# EasyEDA Pro project ProPrj_叶菜清洗机_2026-03-05.epro

# Schematic Schematic1

## Sheets
1 电源设计及主控外围设计: Board Name: Board1; Create Date: 2026-03-05; Page Name: 电源设计及主控外围设计; Project Name: 叶菜清洗机; Schematic Name: Schematic1; Update Date: 2026-03-05; Company: 嘉立创EDA; Page Size: A4; Version: V1.0
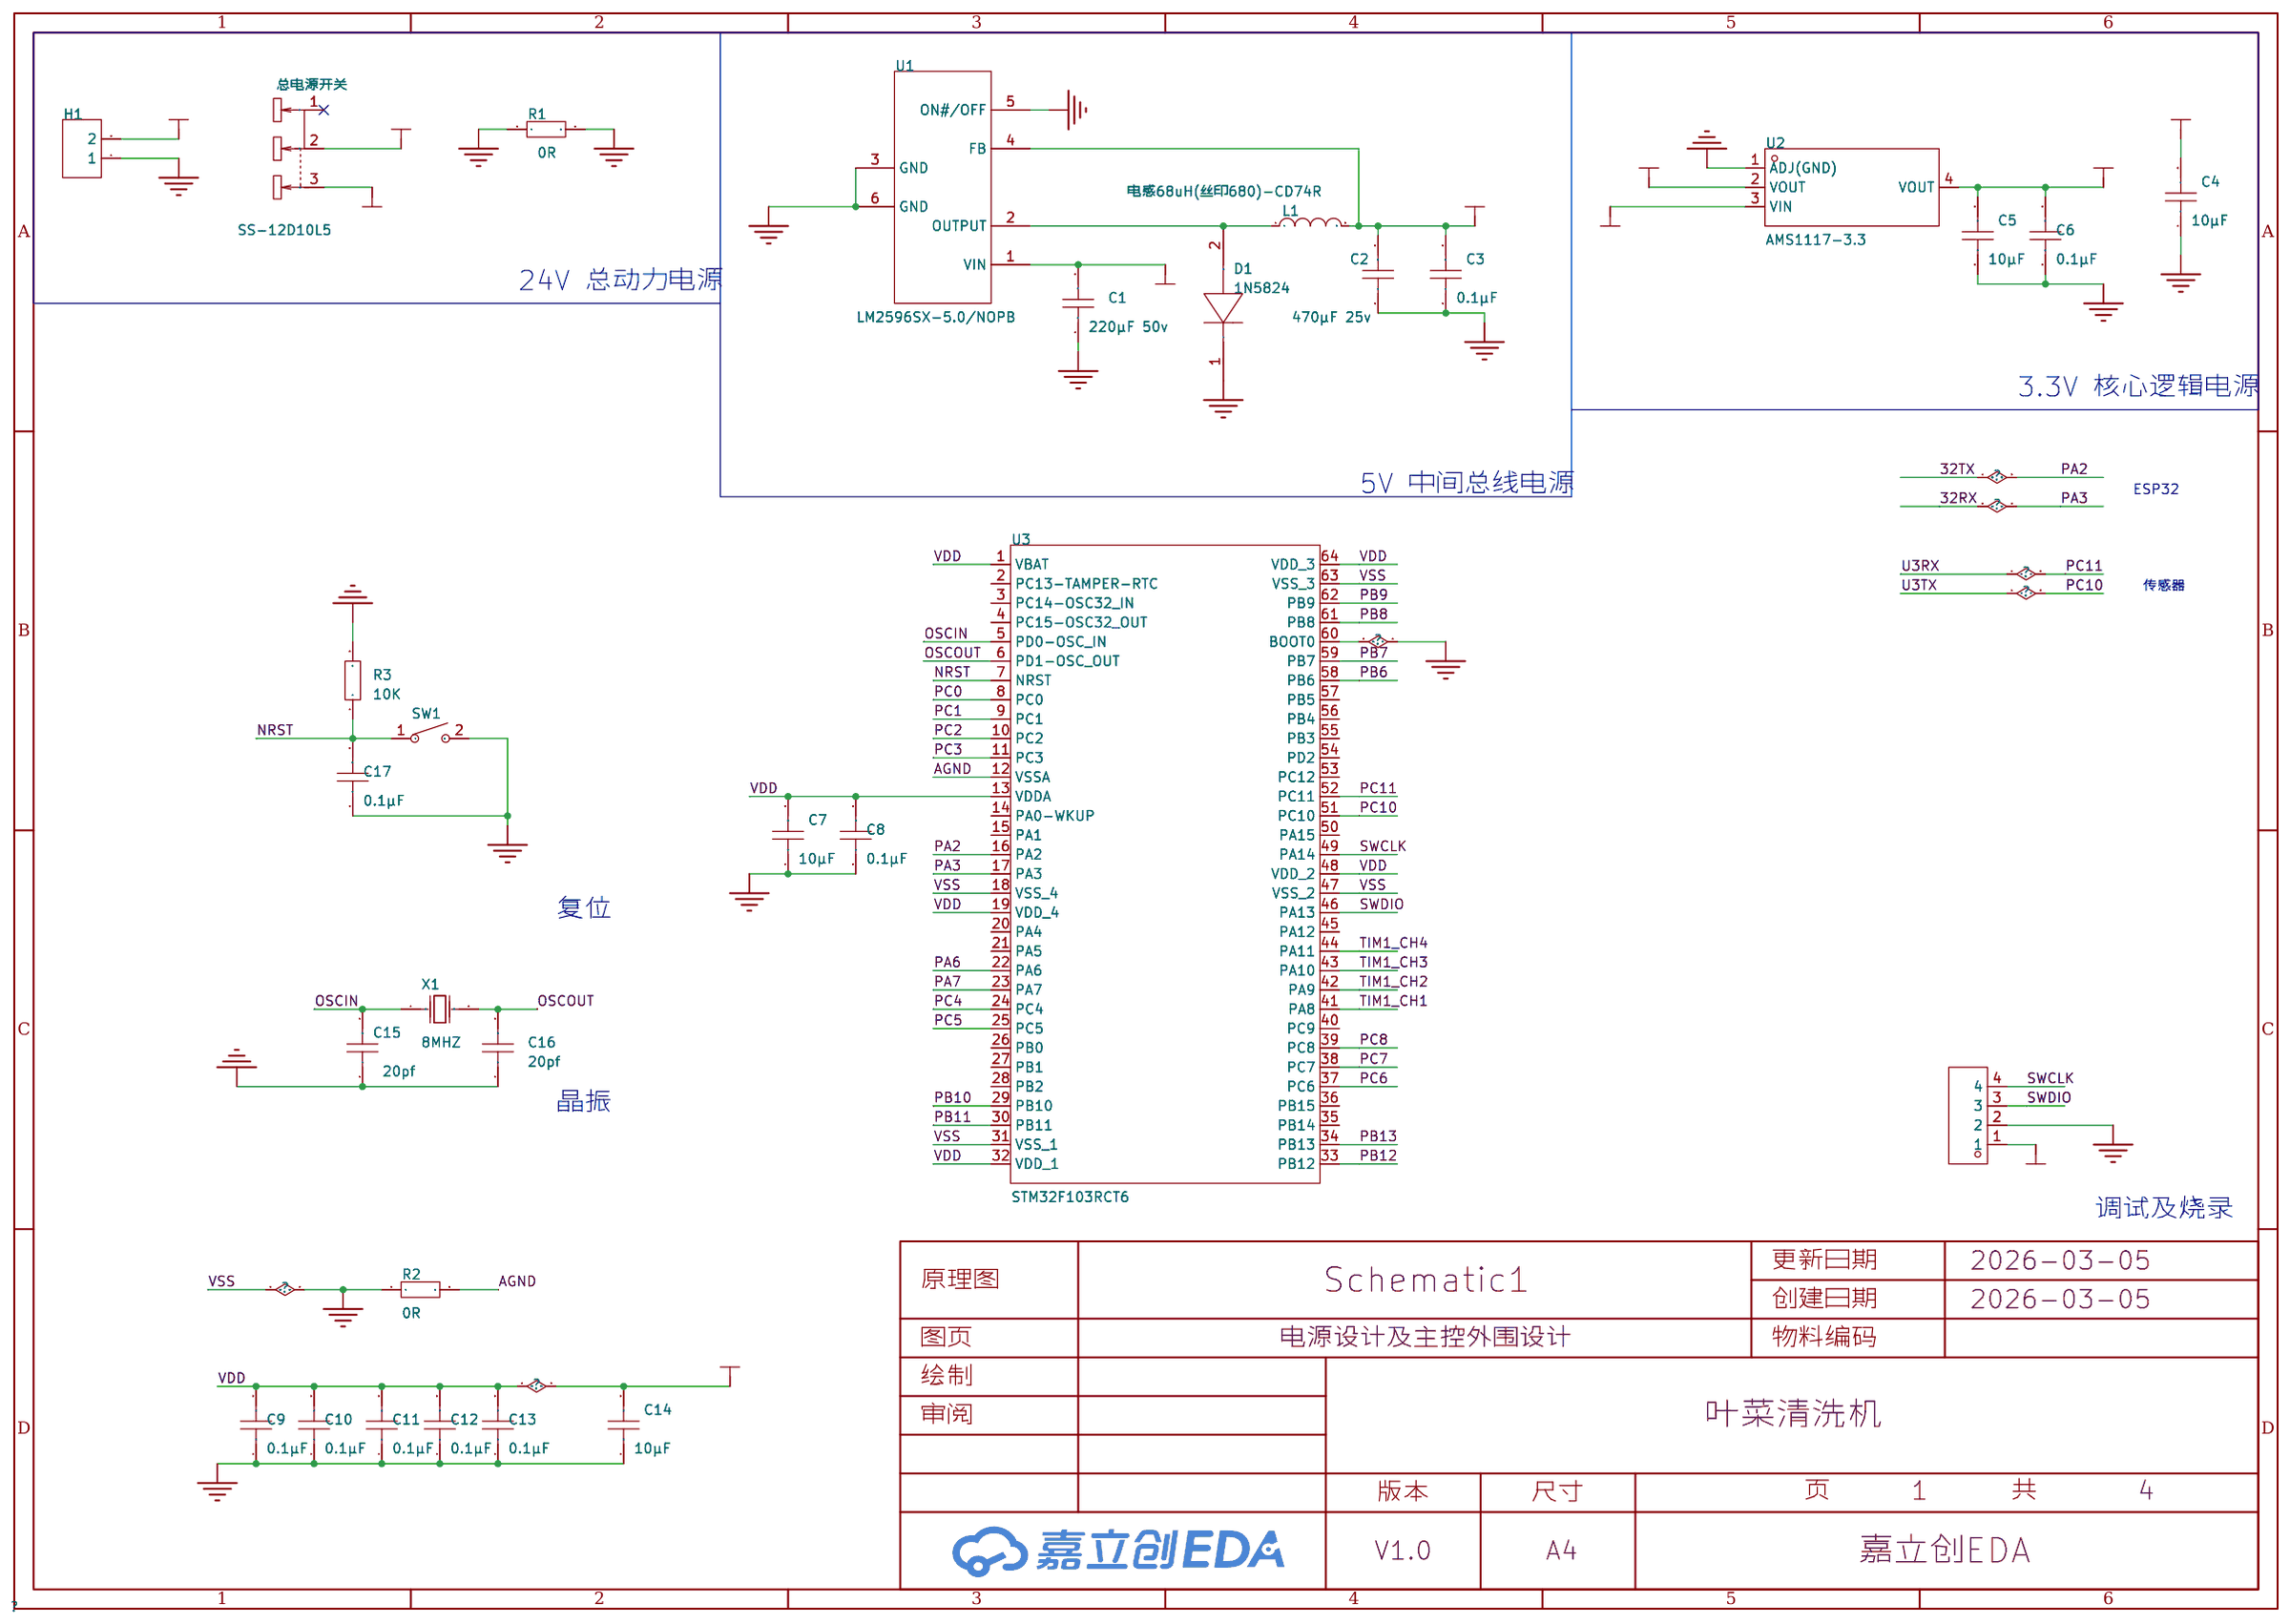
[diagram p0: 电源设计及主控外围设计]
2 电机驱动: Page Name: 电机驱动
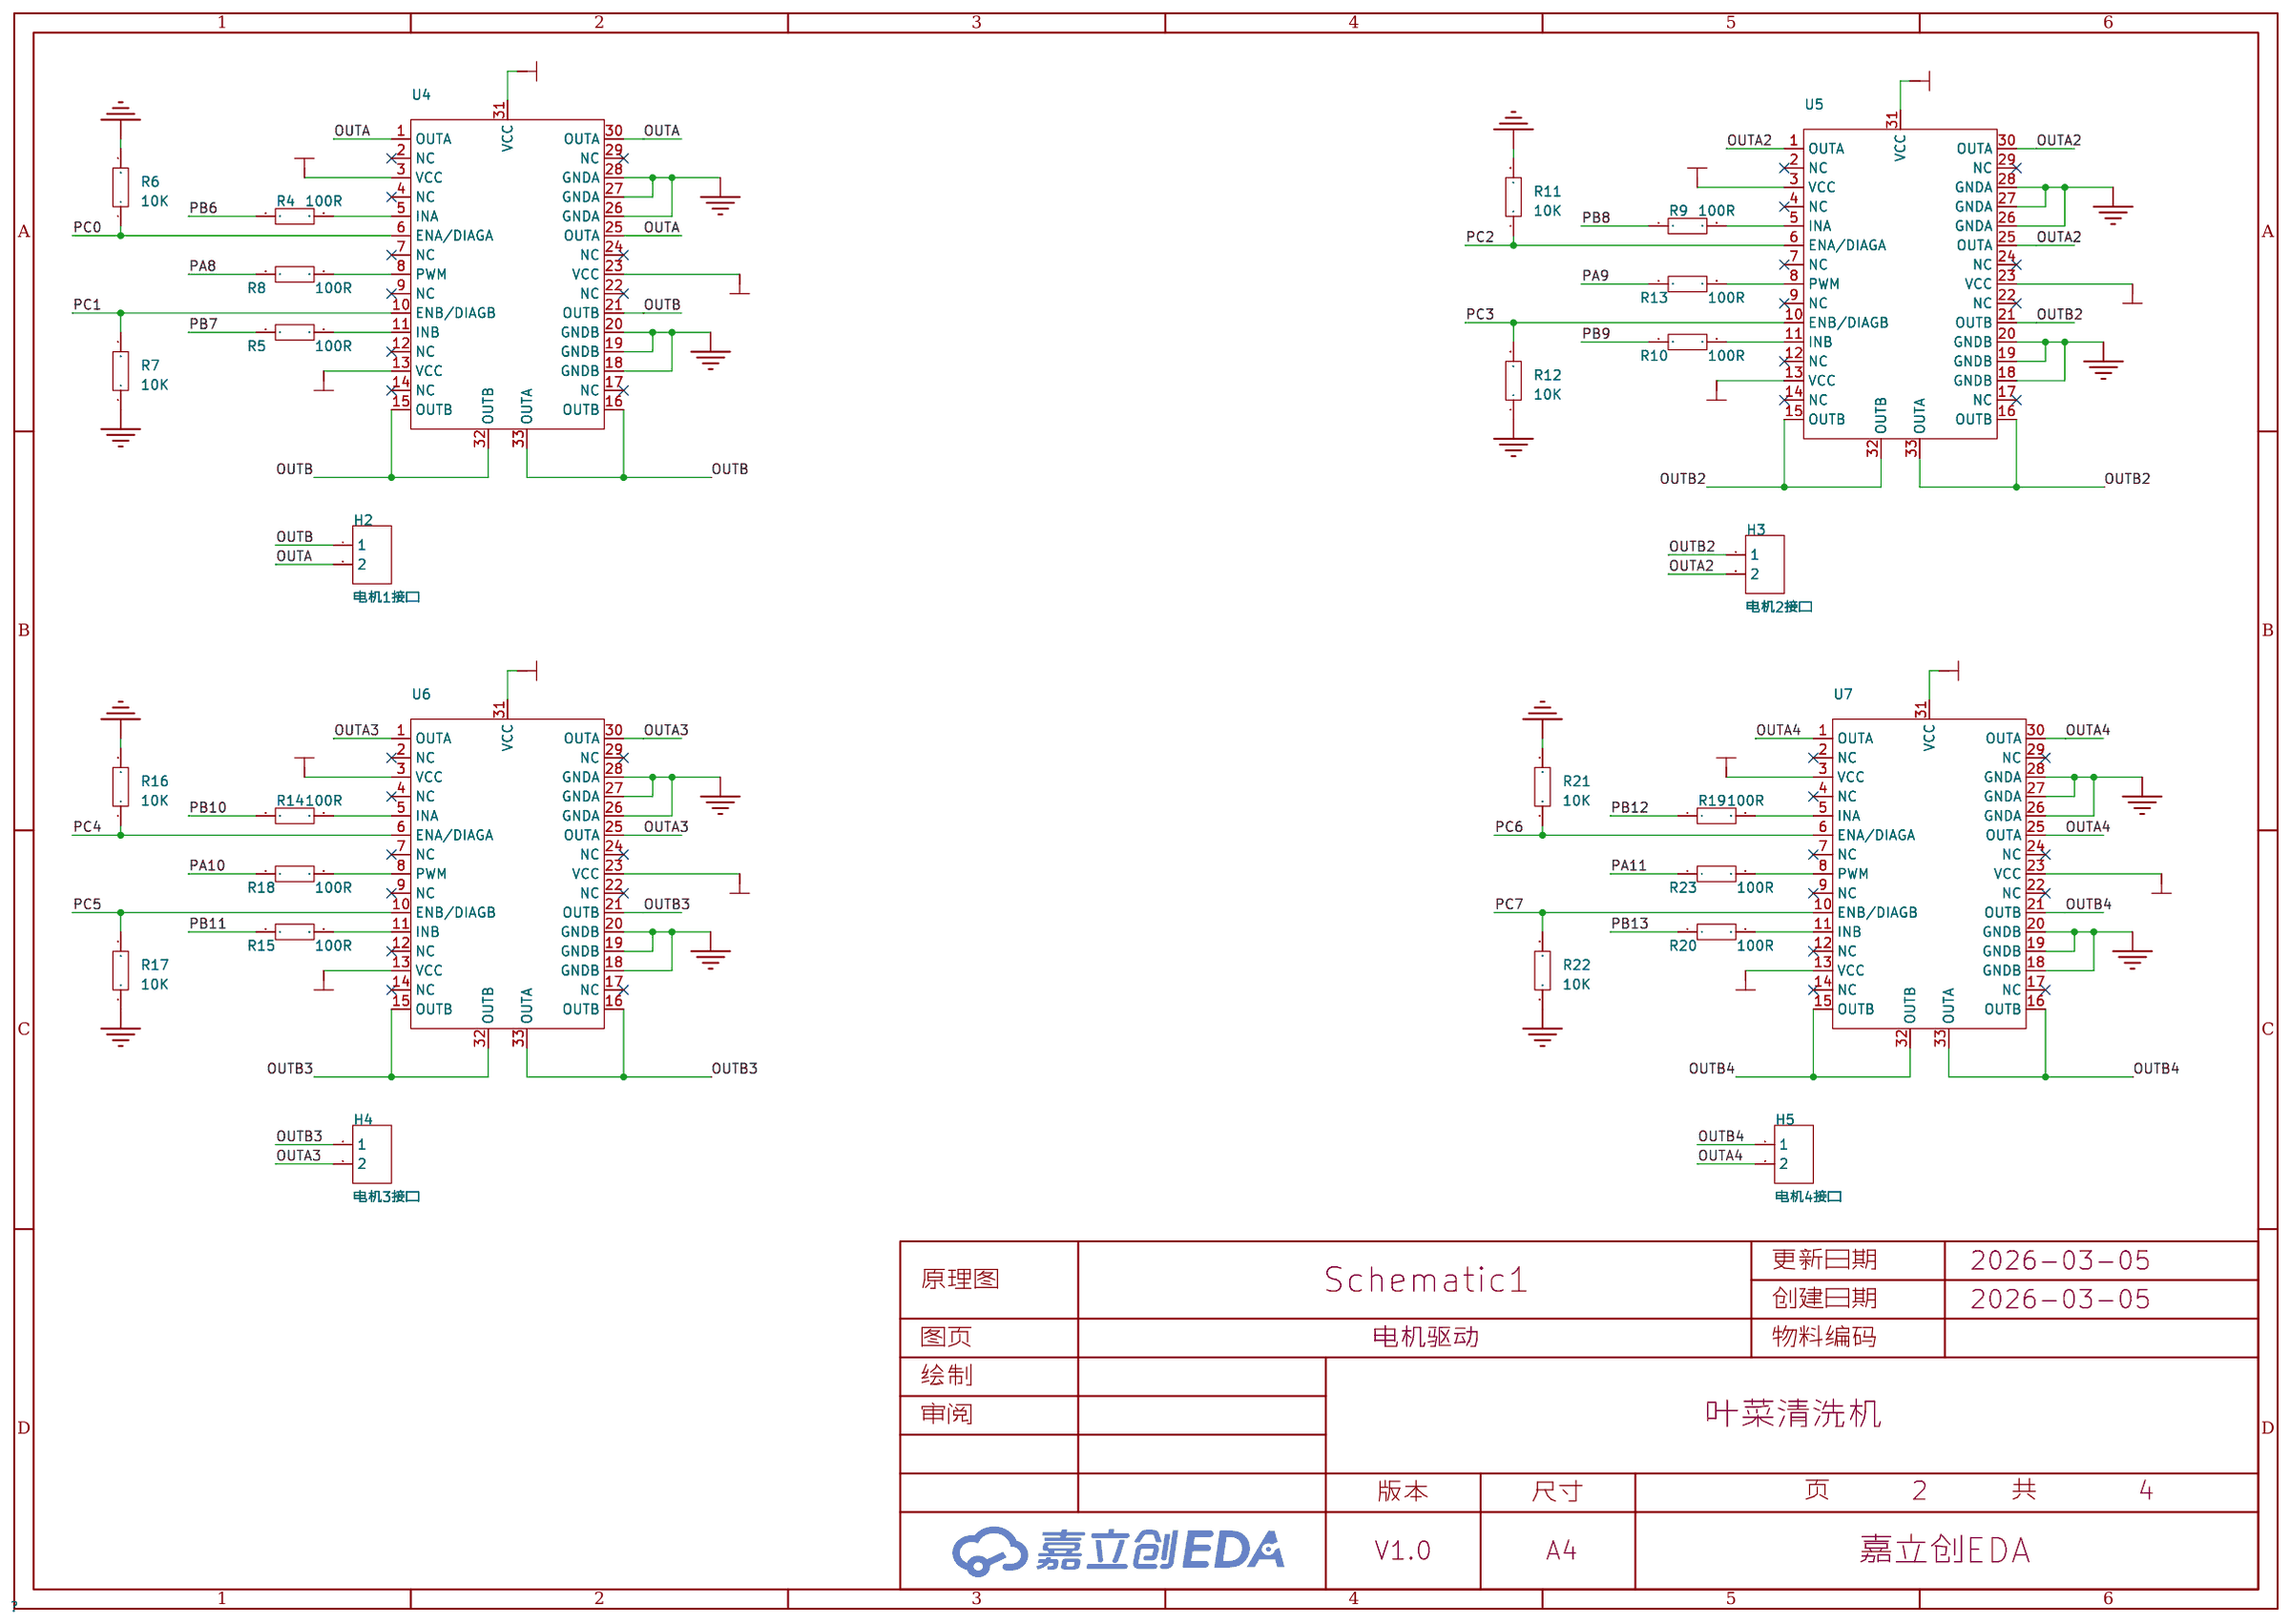
[diagram p1: 电机驱动]
3 水泵，传感器及ESP32: Page Name: 水泵，传感器及ESP32
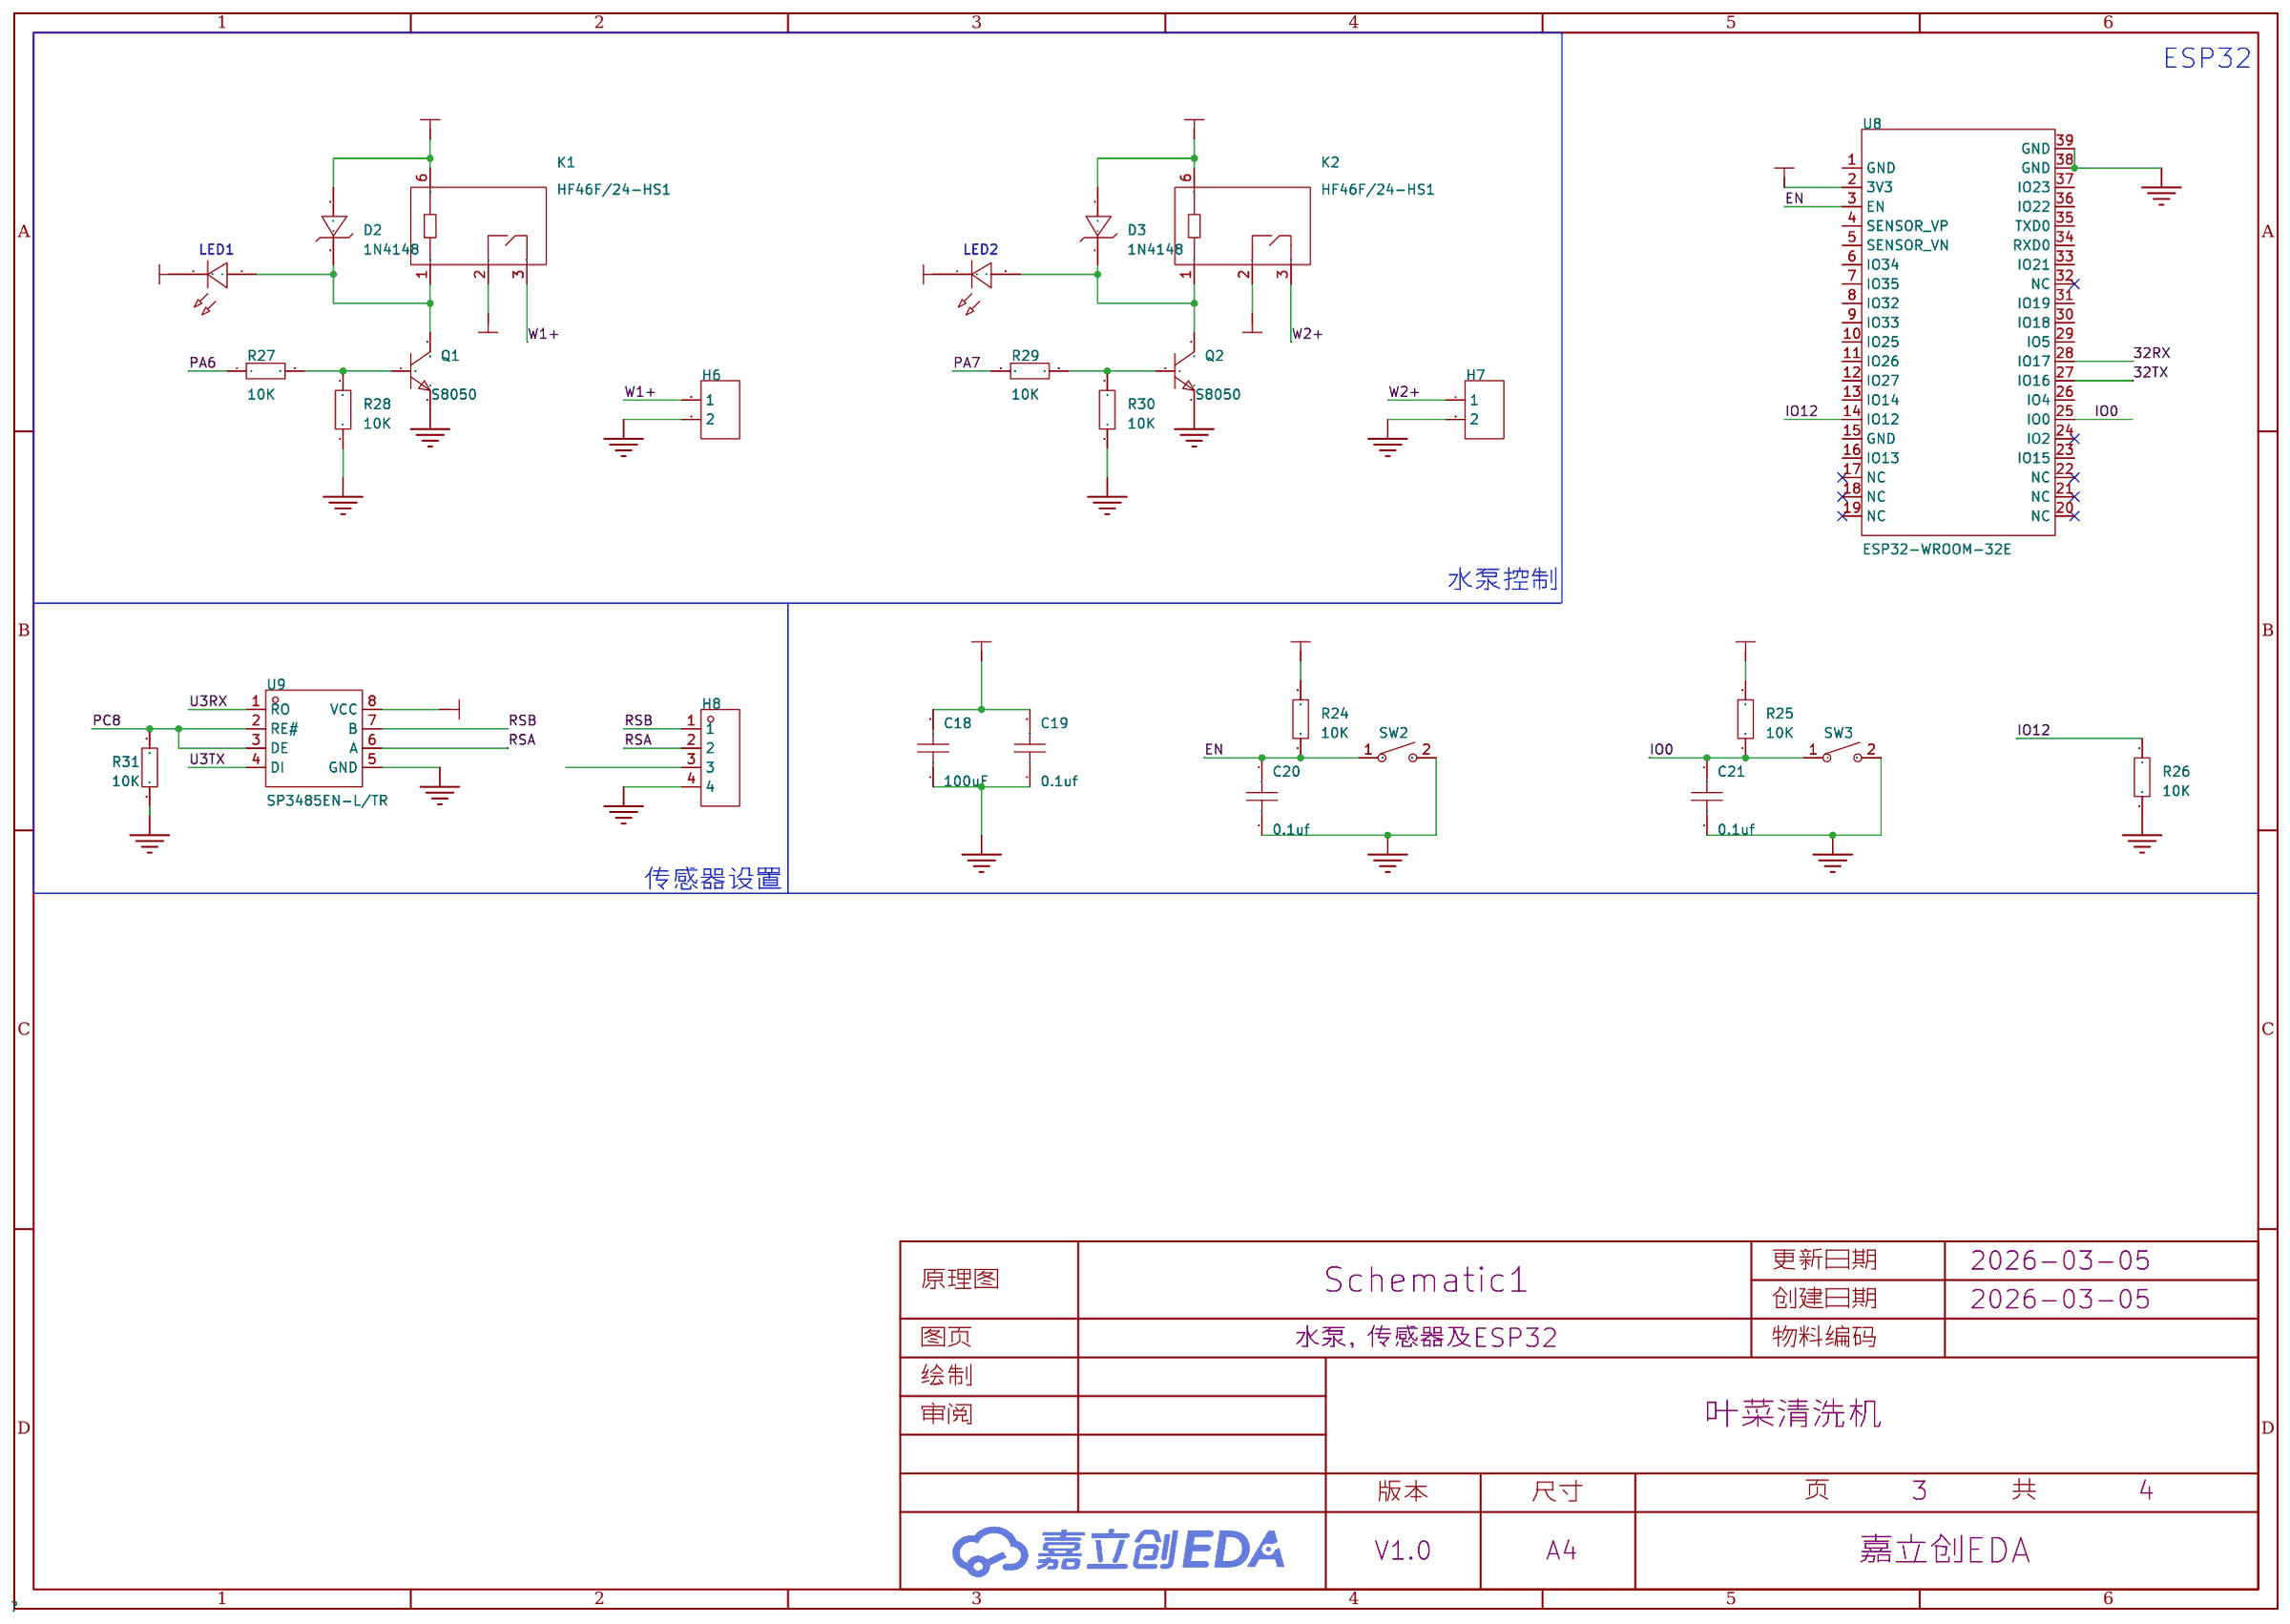
[diagram p2: 水泵，传感器及ESP32]

## Parts
sheet 水泵，传感器及ESP32
C18  100uF  [C0603]
C19  0.1uf  [C0603]
C20  0.1uf  [C0603]
C21  0.1uf  [C0603]
D2  1N4148  [SOD-123_L2.7-W1.7-LS3.8-RD]
D3  1N4148  [SOD-123_L2.7-W1.7-LS3.8-RD]
H6  -  [HDR-TH_2P-P2.54-V-F]
H7  -  [HDR-TH_2P-P2.54-V-F]
H8  -  [HDR-TH_4P-P2.54-V-F]
K1  HF46F/24-HS1  [RELAY-TH_HF46F-24-HS1T]
K2  HF46F/24-HS1  [RELAY-TH_HF46F-24-HS1T]
LED1  -  [LED_0603]
LED2  -  [LED_0603]
Q1  S8050  [SOT-23-3_L2.9-W1.3-P1.90-LS2.4-BR]
Q2  S8050  [SOT-23-3_L2.9-W1.3-P1.90-LS2.4-BR]
R24  10K  [R0603]
R25  10K  [R0603]
R26  10K  [R0603]
R27  10K  [R0603]
R28  10K  [R0603]
R29  10K  [R0603]
R30  10K  [R0603]
R31  10K  [R0603]
SW2  贴片按键ANJIAN_2PIN  [SW-SMD_L6.0-W3.6-LS8.0]
SW3  贴片按键ANJIAN_2PIN  [SW-SMD_L6.0-W3.6-LS8.0]
U8  ESP32-WROOM-32E  [WIFI-SMD_ESP32-WROOM-32E-A]
U9  SP3485EN-L/TR  [SOIC-8_L5.0-W4.0-P1.27-LS6.0-BL]
sheet 电机驱动
H2  电机1接口  [HDR-TH_2P-P2.54-V-F]
H3  电机2接口  [HDR-TH_2P-P2.54-V-F]
H4  电机3接口  [HDR-TH_2P-P2.54-V-F]
H5  电机4接口  [HDR-TH_2P-P2.54-V-F]
R4  100R  [R0603]
R5  100R  [R0603]
R6  10K  [R0603]
R7  10K  [R0603]
R8  100R  [R0603]
R9  100R  [R0603]
R10  100R  [R0603]
R11  10K  [R0603]
R12  10K  [R0603]
R13  100R  [R0603]
R14  100R  [R0603]
R15  100R  [R0603]
R16  10K  [R0603]
R17  10K  [R0603]
R18  100R  [R0603]
R19  100R  [R0603]
R20  100R  [R0603]
R21  10K  [R0603]
R22  10K  [R0603]
R23  100R  [R0603]
U4  VNH3SP30-E  [MULTIPOWERSO-30_L17.2-W16.0-P1.00-LS19.0-BL]
U5  VNH3SP30-E  [MULTIPOWERSO-30_L17.2-W16.0-P1.00-LS19.0-BL]
U6  VNH3SP30-E  [MULTIPOWERSO-30_L17.2-W16.0-P1.00-LS19.0-BL]
U7  VNH3SP30-E  [MULTIPOWERSO-30_L17.2-W16.0-P1.00-LS19.0-BL]
sheet 电源设计及主控外围设计
C1  220µF 50v  [C0603]
C2  470µF 25v  [C0603]
C3  0.1µF  [C0603]
C4  10µF  [C0603]
C5  10µF  [C0603]
C6  0.1µF  [C0603]
C7  10µF  [C0603]
C8  0.1µF  [C0603]
C9  0.1µF  [C0603]
C10  0.1µF  [C0603]
C11  0.1µF  [C0603]
C12  0.1µF  [C0603]
C13  0.1µF  [C0603]
C14  10µF  [C0603]
C15  20pf  [C0603]
C16  20pf  [C0603]
C17  0.1µF  [C0603]
D1  1N5824  [DIO-TH_BD11.4-L8.9-P13.7-RD]
H1  -  [HDR-TH_2P-P2.54-V-F]
L1  电感68uH(丝印680)-CD74R  [IND-SMD_L7.3-W7.3]
R1  0R  [R0603]
R2  0R  [R0603]
R3  10K  [R0603]
SW1  贴片按键ANJIAN_2PIN  [SW-SMD_L6.0-W3.6-LS8.0]
U1  LM2596SX-5.0/NOPB  [TO-263-5_L10.2-W8.9-P1.70-TL]
U2  AMS1117-3.3  [SOT-223-3_L6.5-W3.4-P2.30-LS7.0-BR]
U3  STM32F103RCT6  [LQFP-64_L10.0-W10.0-P0.50-LS12.0-BL]
X1  8MHZ  [HC-49S_L11.5-W5.0-P4.88]
总电源开关  SS-12D10L5  [SW-TH_SS-12D10L5]
调试  -  [HDR-TH_4P-P2.54-V-F]

## Library data of the parts
C1-C21 = CAP_0603: Supplier Footprint: 0603
D2 D3 = 1N4148: Supplier Part: C9900009645; Supplier Footprint: SOD-123_L2.7-W1.7--LS3.8-RD; JLCPCB Part Class: 扩展库; Supplier: LCSC
H1-H7 = HDR-F_2.54_1x2P: Supplier Part: C49661; Supplier Footprint: 插件
H8 调试 = HDR-F_2.54_1x4P: Supplier Part: C2718488; Supplier Footprint: 插件
K1 K2 = HF46F/24-HS1: 线圈电压:24V;触点形式:一组常开:1A(单刀单掷-常开);触点容量(电阻负载):5A@30VDC；5A@250VAC;最大切换电压:277V@AC；30V@DC;最大切换电流:5A;; LCSC Part Name: 超小型中功率24V继电器 单刀单掷-常开; Supplier Part: C5116035; Manufacturer: HF(宏发); Supplier Footprint: 插件,20.5x7mm; JLCPCB Part Class: 扩展库; Datasheet: https://item.szlcsc.com/datasheet/HF46F%252F24-HS1/5690957.html; Supplier: LCSC; Coil Voltage: 24V; Contact Form: 一组常开:1A(单刀单掷-常开); Number of Pins: 4; Contact Rating: 5A@30VDC；5A@250VAC; Switching Voltage(Max): 277V@AC；30V@DC; Coil Rated Power: 200mW; Contact Material: AgNi; Switching Current(Max): 5A; Coil Type: 无极性-单线圈; Coil Resistance: 2.88kΩ; Contact Resistance: 100mΩ; Operate Time: 10ms; Release Time: 10ms; Operating Temperature: -40℃~+85℃
LED1 LED2 = LED_0603-G: Supplier Footprint: 0603
Q1 Q2 = S8050: 晶体管类型:NPN;集电极电流(Ic):500mA;集射极击穿电压(Vceo):25V;耗散功率(Pd):300mW;直流电流增益(hFE):400@50mA,1V;; LCSC Part Name: NPN 电流:500mA 电压:25V; Supplier Part: C2931719; Manufacturer: Doeshare(德芯); Supplier Footprint: SOT-23; JLCPCB Part Class: 扩展库; Datasheet: https://item.szlcsc.com/datasheet/S8050/3273402.html; Supplier: LCSC; type: NPN; Current - Collector(Ic): 500mA; Collector - Emitter Voltage VCEO: 25V; Pd - Power Dissipation: 300mW; DC Current Gain: 400@50mA,1V; Transition frequency(fT): 150MHz; Current - Collector Cutoff: 100nA; Vce Saturation(VCE(sat)): 600mV@500mA,50mA; Emitter-Base Voltage(Vebo): 5V
R1-R31 = Res_0603: Supplier Footprint: 0603
SW1-SW3 = 贴片按键ANJIAN_2PIN: Supplier Part: C9900015641; Supplier Footprint: SMD-2P; JLCPCB Part Class: 扩展库; Supplier: LCSC
U8 = ESP32-WROOM-32E: Supplier Part: C2973652; Manufacturer: ESPRESSIF(乐鑫); Supplier Footprint: SMD,18x25.5mm; JLCPCB Part Class: 扩展库; Datasheet: https://atta.szlcsc.com/upload/public/pdf/source/20220506/2B7DF1E5B41DABC7447F735C715CAF22.pdf; Supplier: LCSC
U9 = SP3485EN-L/TR: 类型:收发器;数据速率:10Mbps;; LCSC Part Name: SP3485 +3.3V低功耗半双工RS-485收发器，数据速率10Mbps; Supplier Part: C8963; Manufacturer: MaxLinear(迈凌); Supplier Footprint: SOIC-8; JLCPCB Part Class: 基础库; Datasheet: https://item.szlcsc.com/datasheet/SP3485EN-L%252FTR/9482.html; Supplier: LCSC; Type: 收发器; Number of Drivers: 1; Number of Receivers: 1; Voltage - Supply: 3.3V; Data Rate: 10Mbps; Number of Nodes: 32; Operating Temperature: -40℃~+85℃; Supply Current (Iq): 2mA; Communication Mode: 半双工
U4-U7 = VNH3SP30-E: 是全桥电机驱动器，适用于广泛的汽车应用。该设备集成了双单片高端驱动器 (HSD) 和两个低端开关。HSD 开关采用专有 VIPower M0-3 技术设计，可在同一芯片上高效集成真正的功率 MOSFET 和智能信号/保护电路。低端开关是采用专有 EHD ("STripFET™") 工艺制造的垂直 MOSFET; LCSC Part Name: 30A 有刷直流电机驱动芯片 36V; Supplier Part: C1556955; Manufacturer: ST(意法半导体); Supplier Footprint: MultiPowerSO-30; JLCPCB Part Class: 扩展库; Datasheet: https://item.szlcsc.com/datasheet/VNH3SP30-E/1647763.html; Supplier: LCSC; Technology: 是; Number of H-bridges: 1; Output Current: 30A; Peak Current: 45A; Voltage - Supply: 5.5V~36V; RDS(on): 45mΩ; Operating Temperature: -40℃~+150℃
D1 = 1N5824: Supplier Part: C9900000323; Supplier Footprint: DO-201AD; JLCPCB Part Class: 扩展库; Supplier: LCSC
L1 = 电感68uH(丝印680)-CD74R: Supplier Part: C9900005374; JLCPCB Part Class: 扩展库; Supplier: LCSC
U1 = LM2596SX-5.0/NOPB: 功能类型:降压型;工作电压:4.5V~40V;输出电压:5V;输出电流:3A;输出类型:固定;; LCSC Part Name: 降压型 3A 4.5V~40V; Supplier Part: C10002; Manufacturer: TI(德州仪器); Supplier Footprint: TO-263-5; JLCPCB Part Class: 扩展库; Datasheet: https://www.ti.com/cn/lit/gpn/lm2596; Supplier: LCSC; Function: 降压型; Voltage - Supply: 4.5V~40V; Output Voltage: 5V; Output Current: 3A; Frequency - Switching: 150kHz; Operating Temperature: -40℃~+125℃@(TJ); Synchronous Rectifier: 否; Number of Outputs: 1; Topology: 降压式; Switch tube (built-in/external): 内置; Output Type: 固定
U2 = AMS1117-3.3: 输出类型:固定;工作电压:18V;输出电压:3.3V;输出电流:1A;电源纹波抑制比(PSRR):60dB@(120Hz);输出极性:正极;; LCSC Part Name: 输入18V 输出3.3V 1A; Supplier Part: C2891839; Manufacturer: YONGYUTAI(永裕泰); Supplier Footprint: SOT-223-3; JLCPCB Part Class: 扩展库; Datasheet: https://item.szlcsc.com/datasheet/AMS1117-3.3/3119758.html; Supplier: LCSC; Output Type: 固定; Voltage - Supply: 18V; Output Voltage: 3.3V; Output Current: 1A; Power Supply Rejection Ratio (PSRR): 60dB@(120Hz); Voltage Dropout: 1.3V@(1A); standby current: 10mA; Noise: 0.005%Vout; Features: 过流保护；过热保护; Operating Temperature: -40℃~+125℃@(Tj); Output Configuration: 正极; Number of Outputs: 1
U3 = STM32F103RCT6: CPU内核:ARM-M3;CPU最大主频:72MHz;应用领域:-;; LCSC Part Name: 主流增强型ARM Cortex-M3 MCU，具有256 KB Flash、72 MHz CPU、电机控制、USB和CAN; Supplier Part: C8323; Manufacturer: ST(意法半导体); Supplier Footprint: LQFP-64(10x10); JLCPCB Part Class: 扩展库; Datasheet: https://item.szlcsc.com/datasheet/STM32F103RCT6/8815.html; Supplier: LCSC; CPU Core: ARM-M3; CPU Maximum Speed: 72MHz; Program Storage Size: 256KB; Program Memory Type: FLASH; Number of I/O: 51; ADC (Bit): 12bit; DAC (Bit): 12bit; Voltage - Supply: 2V~3.6V
X1 = 8MHZ: Supplier Part: C9900021358; Supplier Footprint: X-HC49U直插; JLCPCB Part Class: 扩展库; Supplier: LCSC
总电源开关 = SS-12D10L5: 电路结构:单刀双掷;安装方式:直插;开关颜色:黑色;额定电流(DC):3A;额定电压(DC):125V;额定电流(AC):3A;额定电压(AC):125V;机械寿命:1万次;; LCSC Part Name: 柄长5mm 直插双档 滑动开关; Supplier Part: C319012; Manufacturer: XKB Connectivity(中国星坤); Supplier Footprint: 插件; JLCPCB Part Class: 扩展库; Datasheet: https://atta.szlcsc.com/upload/public/pdf/source/20211009/D6412F37AABE6F9459A6EE7FA4DAEADB.pdf; Supplier: LCSC; Circuit: 单刀双掷; Actuator Style: 矩形柱状; Pin Style: PC引脚; Switch Length: 13mm; Switch Width: 6.8mm; Switch Height: 6.4mm; Mounting Style: 直插; Actuator Color: 黑色; Current Rating (DC): 3A; Voltage Rating (DC): 125V; Current Rating (AC): 3A; Voltage Rating (AC): 125V; Mechanical Life: 1万次; Operating Temperature: -40℃~+85℃

## Nets
+24V: C1.2 D2.2(A) D3.2(A) K1.2 K1.6 K2.2 K2.6 U1.1(VIN) U4.3(VCC) U4.13(VCC) U4.23(VCC) U4.31(VCC) U5.3(VCC) U5.13(VCC) U5.23(VCC) U5.31(VCC) U6.3(VCC) U6.13(VCC) U6.23(VCC) U6.31(VCC) U7.3(VCC) U7.13(VCC) U7.23(VCC) U7.31(VCC) 总电源开关.2
AGND: R2.2 U3.12(VSSA)
GND: C4.1 C5.1 C6.1 C7.1 C8.1 C9.1 C10.1 C11.1 C12.1 C13.1 C14.1 C15.1 C16.1 C17.1 C18.1 C19.1 C20.1 C21.1 H8.4 Q1.2(E) Q2.2(E) R1.2 R2.1 R3.2 R6.2 R7.1 R11.2 R12.1 R16.2 R17.1 R21.2 R22.1 R26.1 R28.1 R30.1 R31.2 SW1.2 SW2.2 SW3.2 U2.1(ADJ(GND)) U3.18(VSS_4) U3.31(VSS_1) U3.47(VSS_2) U3.60(BOOT0) U3.63(VSS_3) U8.38(GND) U8.39(GND) U9.5(GND) 调试.2
PGND: C1.1 C2.1 C3.1 D1.1 H1.1 H6.2 H7.2 R1.1 U1.3(GND) U1.5(ON#/OFF) U1.6(GND) U4.18(GNDB) U4.19(GNDB) U4.20(GNDB) U4.26(GNDA) U4.27(GNDA) U4.28(GNDA) U5.18(GNDB) U5.19(GNDB) U5.20(GNDB) U5.26(GNDA) U5.27(GNDA) U5.28(GNDA) U6.18(GNDB) U6.19(GNDB) U6.20(GNDB) U6.26(GNDA) U6.27(GNDA) U6.28(GNDA) U7.18(GNDB) U7.19(GNDB) U7.20(GNDB) U7.26(GNDA) U7.27(GNDA) U7.28(GNDA)
VCC_3.3V: C5.2 C6.2 C7.2 C8.2 C9.2 C10.2 C11.2 C12.2 C13.2 C14.2 C18.2 C19.2 LED1.1(C) LED2.1(C) R24.2 R25.2 U2.2(VOUT) U2.4(VOUT) U3.1(VBAT) U3.13(VDDA) U3.19(VDD_4) U3.32(VDD_1) U3.48(VDD_2) U3.64(VDD_3) U8.2(3V3) U9.8(VCC) 调试.1
VCC_5V: C2.2 C3.2 C4.2 L1.2 U1.4(FB) U2.3(VIN)
VIN: H1.2 总电源开关.3
32RX: U3.17(PA3) U8.28(IO17)
32TX: U3.16(PA2) U8.27(IO16)
EN: C20.2 R24.1 SW2.1 U8.3(EN)
IO0: C21.2 R25.1 SW3.1 U8.25(IO0)
IO12: R26.2 U8.14(IO12)
NRST: C17.2 R3.1 SW1.1 U3.7(NRST)
OSCIN: C15.2 U3.5(PD0-OSC_IN) X1.1(OSC1)
OSCOUT: C16.2 U3.6(PD1-OSC_OUT) X1.2(OSC2)
OUTA: H2.2 U4.1(OUTA) U4.25(OUTA) U4.30(OUTA)
OUTA2: H3.2 U5.1(OUTA) U5.25(OUTA) U5.30(OUTA)
OUTA3: H4.2 U6.1(OUTA) U6.25(OUTA) U6.30(OUTA)
OUTA4: H5.2 U7.1(OUTA) U7.25(OUTA) U7.30(OUTA)
OUTB: H2.1 U4.15(OUTB) U4.16(OUTB) U4.21(OUTB) U4.32(OUTB) U4.33(OUTA)
OUTB2: H3.1 U5.15(OUTB) U5.16(OUTB) U5.21(OUTB) U5.32(OUTB) U5.33(OUTA)
OUTB3: H4.1 U6.15(OUTB) U6.16(OUTB) U6.21(OUTB) U6.32(OUTB) U6.33(OUTA)
OUTB4: H5.1 U7.15(OUTB) U7.16(OUTB) U7.21(OUTB) U7.32(OUTB) U7.33(OUTA)
PA6: R27.1 U3.22(PA6)
PA7: R29.1 U3.23(PA7)
PA8: R8.1
PA9: R13.1
PA10: R18.1
PA11: R23.1
PB6: R4.1 U3.58(PB6)
PB7: R5.1 U3.59(PB7)
PB8: R9.1 U3.61(PB8)
PB9: R10.1 U3.62(PB9)
PB10: R14.1 U3.29(PB10)
PB11: R15.1 U3.30(PB11)
PB12: R19.1 U3.33(PB12)
PB13: R20.1 U3.34(PB13)
PC0: R6.1 U3.8(PC0) U4.6(ENA/DIAGA)
PC1: R7.2 U3.9(PC1) U4.10(ENB/DIAGB)
PC2: R11.1 U3.10(PC2) U5.6(ENA/DIAGA)
PC3: R12.2 U3.11(PC3) U5.10(ENB/DIAGB)
PC4: R16.1 U3.24(PC4) U6.6(ENA/DIAGA)
PC5: R17.2 U3.25(PC5) U6.10(ENB/DIAGB)
PC6: R21.1 U3.37(PC6) U7.6(ENA/DIAGA)
PC7: R22.2 U3.38(PC7) U7.10(ENB/DIAGB)
PC8: R31.1 U3.39(PC8) U9.2(RE#) U9.3(DE)
PC10: U3.51(PC10) U9.4(DI)
PC11: U3.52(PC11) U9.1(RO)
RSA: H8.2 U9.6(A)
RSB: H8.1 U9.7(B)
SWCLK: U3.49(PA14) 调试.4
SWDIO: U3.46(PA13) 调试.3
TIM1_CH1: U3.41(PA8)
TIM1_CH2: U3.42(PA9)
TIM1_CH3: U3.43(PA10)
TIM1_CH4: U3.44(PA11)
W1+: H6.1 K1.3
W2+: H7.1 K2.3
$1N2061: D1.2 L1.1 U1.2(OUTPUT)
$2N678: R4.2 U4.5(INA)
$2N733: R5.2 U4.11(INB)
$2N884: R8.2 U4.8(PWM)
$2N1346: R9.2 U5.5(INA)
$2N1351: R10.2 U5.11(INB)
$2N1357: R13.2 U5.8(PWM)
$2N1824: R14.2 U6.5(INA)
$2N1829: R15.2 U6.11(INB)
$2N1835: R18.2 U6.8(PWM)
$2N2302: R19.2 U7.5(INA)
$2N2307: R20.2 U7.11(INB)
$2N2313: R23.2 U7.8(PWM)
$4N363: Q1.1(B) R27.2 R28.2
$4N464: D2.1(K) K1.1 LED1.2(A) Q1.3(C)
$4N1332: Q2.1(B) R29.2 R30.2
$4N1339: D3.1(K) K2.1 LED2.2(A) Q2.3(C)

Not connected (* = marked no-connect by the designer): H8 3; U3 2(PC13-TAMPER-RTC) 3(PC14-OSC32_IN) 4(PC15-OSC32_OUT) 14(PA0-WKUP) 15(PA1) 20(PA4) 21(PA5) 26(PB0) 27(PB1) 28(PB2) 35(PB14) 36(PB15) 40(PC9) 45(PA12) 50(PA15) 53(PC12) 54(PD2) 55(PB3) 56(PB4) 57(PB5); U4 2(NC)* 4(NC)* 7(NC)* 9(NC)* 12(NC)* 14(NC)* 17(NC)* 22(NC)* 24(NC)* 29(NC)*; U5 2(NC)* 4(NC)* 7(NC)* 9(NC)* 12(NC)* 14(NC)* 17(NC)* 22(NC)* 24(NC)* 29(NC)*; U6 2(NC)* 4(NC)* 7(NC)* 9(NC)* 12(NC)* 14(NC)* 17(NC)* 22(NC)* 24(NC)* 29(NC)*; U7 2(NC)* 4(NC)* 7(NC)* 9(NC)* 12(NC)* 14(NC)* 17(NC)* 22(NC)* 24(NC)* 29(NC)*; U8 1(GND) 4(SENSOR_VP) 5(SENSOR_VN) 6(IO34) 7(IO35) 8(IO32) 9(IO33) 10(IO25) 11(IO26) 12(IO27) 13(IO14) 15(GND) 16(IO13) 17(NC)* 18(NC)* 19(NC)* 20(NC)* 21(NC)* 22(NC)* 23(IO15) 24(IO2)* 26(IO4) 29(IO5) 30(IO18) 31(IO19) 32(NC)* 33(IO21) 34(RXD0) 35(TXD0) 36(IO22) 37(IO23); 总电源开关 1*

## Notes on the sheets
sheet 1
- 24V 总动力电源
- 3.3V 核心逻辑电源
- 5V 中间总线电源
- ESP32
- 传感器
- 复位
- 晶振
- 调试及烧录
sheet 3
- ESP32
- 水泵控制
- 传感器设置

# Board PCB1
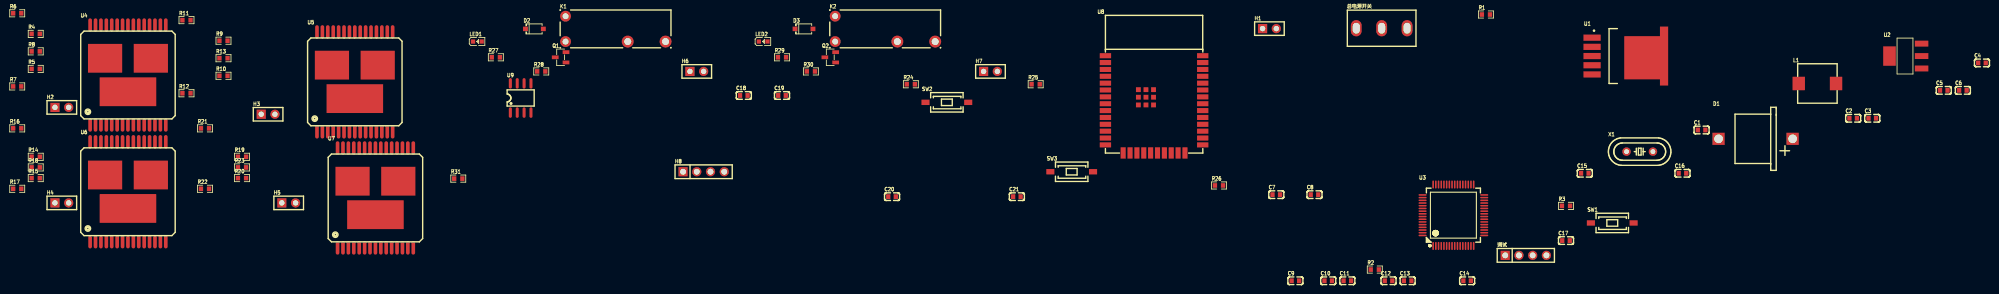
[diagram p3: board, top side]
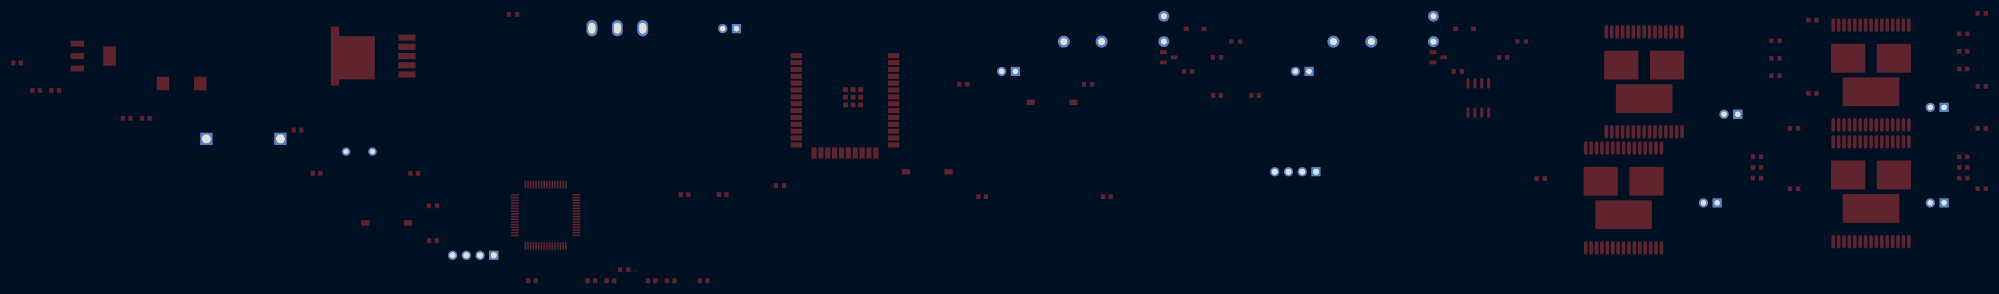
[diagram p4: board, bottom side, seen from below]

No outline. copper layers: Top Layer, Bottom Layer. Coordinates in mm from the lowest, leftmost part position.
Stack: Top Layer 0.035mm / Dielectric1 1.51mm FR4 er 4.5 / Bottom Layer 0.035mm

## Design rules (mm)
template: JLCPCB Capability(Two Layers Board)
spacing copperThickness1oz (default): track to track 0.102, other pairs 0.152 to 0.3
spacing copperThickness2oz: track to track 0.203, other pairs 0.152 to 0.3
track width copperThickness1oz (default): min 0.127, default 0.254, max 2.54
track width copperThickness2oz: min 0.203, default 0.254, max 2.54
differential pair differentialPair (default): width min 0.127, default 0.254, max 2.54; gap min 0.152, default 0.152
via viaSize (default): diameter min 0.5, default 0.61, max 10; hole min 0.3, default 0.305, max 6.3

## Placement (name value [footprint] x y rotation side)
C1  220µF 50v  [C0603]  311.59 27.92 0 top
C2  470µF 25v  [C0603]  339.62 30.09 0 top
C3  0.1µF  [C0603]  343.16 30.09 0 top
C4  10µF  [C0603]  363.45 40.34 0 top
C5  10µF  [C0603]  356.38 35.26 0 top
C6  0.1µF  [C0603]  359.92 35.26 0 top
C7  10µF  [C0603]  232.91 15.94 0 top
C8  0.1µF  [C0603]  239.98 15.94 0 top
C9  0.1µF  [C0603]  236.44 0 0 top
C10  0.1µF  [C0603]  242.52 0 0 top
C11  0.1µF  [C0603]  246.05 0 0 top
C12  0.1µF  [C0603]  253.67 0 0 top
C13  0.1µF  [C0603]  257.21 0 0 top
C14  10µF  [C0603]  268.21 0 0 top
C15  20pf  [C0603]  289.98 19.91 0 top
C16  20pf  [C0603]  308.05 19.91 0 top
C17  0.1µF  [C0603]  286.5 7.44 0 top
C18  100uF  [C0603]  134.41 34.31 0 top
C19  0.1uf  [C0603]  141.47 34.31 0 top
C20  0.1uf  [C0603]  161.83 15.57 0 top
C21  0.1uf  [C0603]  184.92 15.57 0 top
D1  1N5824  [DIO-TH_BD11.4-L8.9-P13.7-RD]  321.58 26.28 0 top
D2  1N4148  [SOD-123_L2.7-W1.7-LS3.8-RD]  95.67 46.64 0 top
D3  1N4148  [SOD-123_L2.7-W1.7-LS3.8-RD]  145.55 46.64 0 top
H1  -  [HDR-TH_2P-P2.54-V-F]  231.64 46.69 0 top
H2  电机1接口  [HDR-TH_2P-P2.54-V-F]  8.25 32.1 0 top
H3  电机2接口  [HDR-TH_2P-P2.54-V-F]  46.41 30.83 0 top
H4  电机3接口  [HDR-TH_2P-P2.54-V-F]  8.25 14.42 0 top
H5  电机4接口  [HDR-TH_2P-P2.54-V-F]  50.22 14.42 0 top
H6  -  [HDR-TH_2P-P2.54-V-F]  125.71 38.76 0 top
H7  -  [HDR-TH_2P-P2.54-V-F]  180.04 38.76 0 top
H8  -  [HDR-TH_4P-P2.54-V-F]  126.98 20.19 0 top
K1  HF46F/24-HS1  [RELAY-TH_HF46F-24-HS1T]  110.68 46.64 0 top
K2  HF46F/24-HS1  [RELAY-TH_HF46F-24-HS1T]  160.56 46.64 0 top
L1  电感68uH(丝印680)-CD74R  [IND-SMD_L7.3-W7.3]  333.01 36.53 0 top
LED1  -  [LED_0603]  85.16 44.31 0 top
LED2  -  [LED_0603]  138.04 44.31 0 top
Q1  S8050  [SOT-23-3_L2.9-W1.3-P1.90-LS2.4-BR]  100.52 41.38 0 top
Q2  S8050  [SOT-23-3_L2.9-W1.3-P1.90-LS2.4-BR]  150.4 41.38 0 top
R1  0R  [R0603]  271.69 49.3 0 top
R2  0R  [R0603]  251.13 2.07 0 top
R3  10K  [R0603]  286.5 13.87 0 top
R4  100R  [R0603]  3.42 45.72 0 top
R5  100R  [R0603]  3.42 39.23 0 top
R6  10K  [R0603]  0 49.53 0 top
R7  10K  [R0603]  0 35.99 0 top
R8  100R  [R0603]  3.42 42.47 0 top
R9  100R  [R0603]  38.16 44.45 0 top
R10  100R  [R0603]  38.16 37.96 0 top
R11  10K  [R0603]  31.31 48.26 0 top
R12  10K  [R0603]  31.31 34.72 0 top
R13  100R  [R0603]  38.16 41.2 0 top
R14  100R  [R0603]  3.42 22.96 0 top
R15  100R  [R0603]  3.42 19.01 0 top
R16  10K  [R0603]  0 28.22 0 top
R17  10K  [R0603]  0 17.03 0 top
R18  100R  [R0603]  3.42 20.98 0 top
R19  100R  [R0603]  41.58 22.96 0 top
R20  100R  [R0603]  41.58 19.01 0 top
R21  10K  [R0603]  34.73 28.22 0 top
R22  10K  [R0603]  34.73 17.03 0 top
R23  100R  [R0603]  41.58 20.98 0 top
R24  10K  [R0603]  165.31 36.38 0 top
R25  10K  [R0603]  188.4 36.38 0 top
R26  10K  [R0603]  222.31 17.65 0 top
R27  10K  [R0603]  88.54 41.38 0 top
R28  10K  [R0603]  96.94 38.76 0 top
R29  10K  [R0603]  141.47 41.38 0 top
R30  10K  [R0603]  146.82 38.76 0 top
R31  10K  [R0603]  81.59 18.92 0 top
SW1  贴片按键ANJIAN_2PIN  [SW-SMD_L6.0-W3.6-LS8.0]  295.06 10.71 0 top
SW2  贴片按键ANJIAN_2PIN  [SW-SMD_L6.0-W3.6-LS8.0]  171.97 33.04 0 top
SW3  贴片按键ANJIAN_2PIN  [SW-SMD_L6.0-W3.6-LS8.0]  195.06 20.19 0 top
U1  LM2596SX-5.0/NOPB  [TO-263-5_L10.2-W8.9-P1.70-TL]  296.33 41.61 0 top
U2  AMS1117-3.3  [SOT-223-3_L6.5-W3.4-P2.30-LS7.0-BR]  349.32 41.61 0 top
U3  STM32F103RCT6  [LQFP-64_L10.0-W10.0-P0.50-LS12.0-BL]  265.67 12.13 0 top
U4  VNH3SP30-E  [MULTIPOWERSO-30_L17.2-W16.0-P1.00-LS19.0-BL]  20.48 38.1 0 top
U5  VNH3SP30-E  [MULTIPOWERSO-30_L17.2-W16.0-P1.00-LS19.0-BL]  62.45 36.83 0 top
U6  VNH3SP30-E  [MULTIPOWERSO-30_L17.2-W16.0-P1.00-LS19.0-BL]  20.48 16.49 0 top
U7  VNH3SP30-E  [MULTIPOWERSO-30_L17.2-W16.0-P1.00-LS19.0-BL]  66.26 15.34 0 top
U8  ESP32-WROOM-32E  [WIFI-SMD_ESP32-WROOM-32E-A]  210.3 32.67 0 top
U9  SP3485EN-L/TR  [SOIC-8_L5.0-W4.0-P1.27-LS6.0-BL]  93.13 33.84 0 top
X1  8MHZ  [HC-49S_L11.5-W5.0-P4.88]  300.14 23.91 0 top
总电源开关  SS-12D10L5  [SW-TH_SS-12D10L5]  252.4 46.76 0 top
调试  -  [HDR-TH_4P-P2.54-V-F]  279.07 4.71 0 top

## Footprints (pads in the part's own frame, mm; a bottom-side part is the same pattern mirrored in y, then rotated)
C0603
  rect 0.8x0.9 smd: 1(-0.7,0) 2(0.7,0)
DIO-TH_BD11.4-L8.9-P13.7-RD
  rect 2.25x2.25 hole 1.6: 1(-6.85,0) 2(6.85,0)
HC-49S_L11.5-W5.0-P4.88
  round 1.56 hole 0.9: 1(-2.44,0) 2(2.44,0)
HDR-TH_2P-P2.54-V-F
  rect 1.7x1.7 hole 1: 1(-1.27,0)
  round 1.7 hole 1: 2(1.27,0)
HDR-TH_4P-P2.54-V-F
  rect 1.7x1.7 hole 1.1: 1(-3.81,0)
  round 1.7 hole 1.1: 2(-1.27,0) 3(1.27,0) 4(3.81,0)
IND-SMD_L7.3-W7.3
  rect 2.3x2.5 smd: 1(-3.45,0) 2(3.45,0)
LED_0603
  rect 0.8x0.8 smd: 1(-0.851,-0.01) 2(0.75,-0.005)
LQFP-64_L10.0-W10.0-P0.50-LS12.0-BL
  oval 0.3x1.5 smd: 1(-3.75,-5.688) 2(-3.25,-5.688) 3(-2.75,-5.688) 4(-2.25,-5.688) 5(-1.75,-5.688) 6(-1.25,-5.688) 7(-0.75,-5.688) 8(-0.25,-5.688) 9(0.25,-5.688) 10(0.75,-5.688) 11(1.25,-5.688) 12(1.75,-5.688) 13(2.25,-5.688) 14(2.75,-5.688) 15(3.25,-5.688) 16(3.75,-5.688) 33(3.75,5.688) 34(3.25,5.688) 35(2.75,5.688) 36(2.25,5.688) 37(1.75,5.688) 38(1.25,5.688) 39(0.75,5.688) 40(0.25,5.688) 41(-0.25,5.688) 42(-0.75,5.688) 43(-1.25,5.688) 44(-1.75,5.688) 45(-2.25,5.688) 46(-2.75,5.688) 47(-3.25,5.688) 48(-3.75,5.688)
  oval 1.5x0.3 smd: 17(5.7,-3.738) 18(5.7,-3.238) 19(5.7,-2.738) 20(5.7,-2.238) 21(5.7,-1.738) 22(5.7,-1.238) 23(5.7,-0.739) 24(5.7,-0.238) 25(5.7,0.262) 26(5.7,0.762) 27(5.7,1.262) 28(5.7,1.762) 29(5.7,2.261) 30(5.7,2.762) 31(5.7,3.261) 32(5.7,3.762) 49(-5.7,3.762) 50(-5.7,3.261) 51(-5.7,2.762) 52(-5.7,2.261) 53(-5.7,1.762) 54(-5.7,1.262) 55(-5.7,0.762) 56(-5.7,0.262) 57(-5.7,-0.238) 58(-5.7,-0.739) 59(-5.7,-1.238) 60(-5.7,-1.738) 61(-5.7,-2.238) 62(-5.7,-2.738) 63(-5.7,-3.238) 64(-5.7,-3.738)
MULTIPOWERSO-30_L17.2-W16.0-P1.00-LS19.0-BL
  oval 0.68x2.5 smd: 1(-7,-9.245) 2(-6,-9.245) 3(-5,-9.245) 4(-4,-9.245) 5(-3,-9.245) 6(-2,-9.245) 7(-1,-9.245) 8(0,-9.245) 9(1,-9.245) 10(2,-9.245) 11(3,-9.245) 12(4,-9.245) 13(5,-9.245) 14(6,-9.245) 15(7,-9.245) 16(7,9.245) 17(6,9.245) 18(5,9.245) 19(4,9.245) 20(3,9.245) 21(2,9.245) 22(1,9.245) 23(0,9.245) 24(-1,9.245) 25(-2,9.245) 26(-3,9.245) 27(-4,9.245) 28(-5,9.245) 29(-6,9.245) 30(-7,9.245)
  rect 10.465x5.334 smd: 31(0,-3.099)
  rect 6.33x5.334 smd: 32(4.231,3.099) 33(-4.231,3.099)
R0603
  rect 0.806x0.864 smd: 1(-0.753,0) 2(0.753,0)
RELAY-TH_HF46F-24-HS1T
  round 2 hole 1.1: 1(-9.25,-2.35) 6(-9.25,2.35)
  round 2.2 hole 1.3: 2(2.25,-2.35) 3(9.25,-2.35)
SOD-123_L2.7-W1.7-LS3.8-RD
  rect 0.91x0.84 smd: 1(-1.655,0) 2(1.655,0)
SOIC-8_L5.0-W4.0-P1.27-LS6.0-BL
  oval 0.569x1.95 smd: 1(-1.905,-2.705) 2(-0.635,-2.705) 3(0.635,-2.705) 4(1.905,-2.705) 5(1.905,2.705) 6(0.635,2.705) 7(-0.635,2.705) 8(-1.905,2.705)
SOT-23-3_L2.9-W1.3-P1.90-LS2.4-BR
  rect 1.25x0.7 smd: 1(1,-0.95) 2(1,0.95) 3(-1,0)
SOT-223-3_L6.5-W3.4-P2.30-LS7.0-BR
  rect 2.5x1.1 smd: 1(2.97,-2.3) 2(2.97,0) 3(2.97,2.3)
  rect 2.34x3.6 smd: 4(-2.97,0)
SW-SMD_L6.0-W3.6-LS8.0
  rect 1.5x1 smd: 1(-3.95,0) 2(3.95,0)
SW-TH_SS-12D10L5
  oval 2x3 hole 1.3x2: 1(-4.7,0) 2(0,0) 3(4.7,0)
TO-263-5_L10.2-W8.9-P1.70-TL
  rect 3.2x1.15 smd: 1(-5.008,3.404) 2(-5.008,1.702) 3(-5.008,0) 4(-5.008,-1.702) 5(-5.008,-3.404)
  custom 8.128x10.922 smd: 6(5.008,-0.318)
WIFI-SMD_ESP32-WROOM-32E-A
  rect 2.1x0.95 smd: 1(-9,9.002) 2(-9,7.732) 3(-9,6.463) 4(-9,5.192) 5(-9,3.922) 6(-9,2.652) 7(-9,1.383) 8(-9,0.113) 9(-9,-1.157) 10(-9,-2.428) 11(-9,-3.697) 12(-9,-4.968) 13(-9,-6.237) 14(-9,-7.508) 25(9,-7.508) 26(9,-6.237) 27(9,-4.968) 28(9,-3.697) 29(9,-2.428) 30(9,-1.157) 31(9,0.113) 32(9,1.383) 33(9,2.652) 34(9,3.922) 35(9,5.192) 36(9,6.463) 37(9,7.732) 38(9,9.002)
  rect 0.95x2.1 smd: 15(-5.715,-9.002) 16(-4.444,-9.002) 17(-3.175,-9.002) 18(-1.905,-9.002) 19(-0.634,-9.002) 20(0.635,-9.002) 21(1.905,-9.002) 22(3.175,-9.002) 23(4.446,-9.002) 24(5.715,-9.002)
  rect 0.9x0.9 smd: 39(-2.9,2.721) 39(-2.9,1.321) 39(-2.9,-0.108) 39(-1.5,2.721) 39(-1.5,1.321) 39(-1.5,-0.108) 39(-0.1,2.721) 39(-0.1,1.321) 39(-0.1,-0.108)

## Nets
As in the schematic.

Pads without a net: U3 2 3 4 14 15 20 21 26 27 28 35 36 40 45 50 53 54 55 56 57; U4 2 4 7 9 12 14 17 22 24 29; U5 2 4 7 9 12 14 17 22 24 29; U6 2 4 7 9 12 14 17 22 24 29; U7 2 4 7 9 12 14 17 22 24 29; U8 1 4 5 6 7 8 9 10 11 12 13 15 16 17 18 19 20 21 22 23 24 26 29 30 31 32 33 34 35 36 37; 总电源开关 1
